# EAGLE schematic Eingangsschaltung (EAGLE 6.6.0)
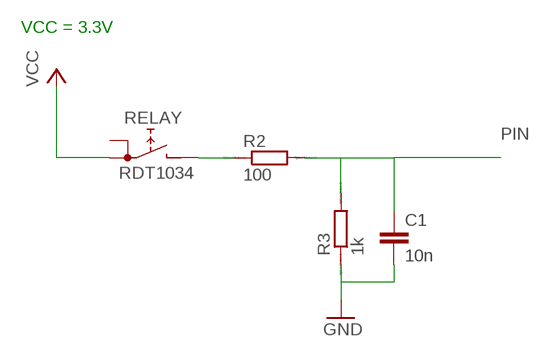
[diagram p0: schematic, sheet 1]

## Parts
C1  10n  C-EU025-025X050  [C025-025X050]
R2  100  R0204/7  [0204/7]
R3  1k  R0204/7  [0204/7]
RELAY  RDT1034  [RDT1034]

## Nets
GND: C1.2 R3.1
N$2: R2.1 RELAY.B
PIN: C1.1 R2.2 R3.2
VCC: RELAY.A1
Unconnected: RELAY.A

## Notes on the sheet
- VCC = 3.3V

## Library data of the parts
C1 = rcl:C-EU: CAPACITOR, European symbol
R2 R3 = eagle-ltspice:R: RESISTOR, European symbol; SPICEMODEL: NONE; SPICEPREFIX: R
RELAY = switch:RDT1034: PUSH SWITCH www.radiohm.com